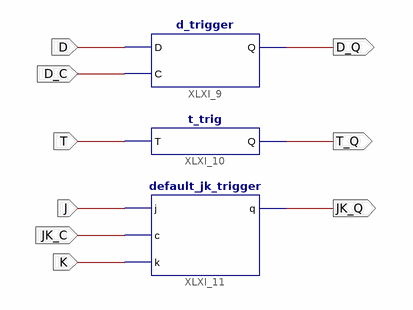
[diagram p0: schematic sheet 1]
// Xilinx ISE schematic main.sch (spartan6) as structural Verilog: 3 symbols, 9 ports
module main (
  input  D,
  input  D_C,
  input  T,
  input  J,
  input  JK_C,
  input  K,
  output D_Q,
  output T_Q,
  output JK_Q
);

  d_trigger XLXI_9 (.D(D), .C(D_C), .Q(D_Q));
  t_trig XLXI_10 (.T(T), .Q(T_Q));
  default_jk_trigger XLXI_11 (.j(J), .c(JK_C), .k(K), .q(JK_Q));
endmodule
